# EAGLE schematic LEDSubMatrixHighDensity_v3 (EAGLE 9.6.2)
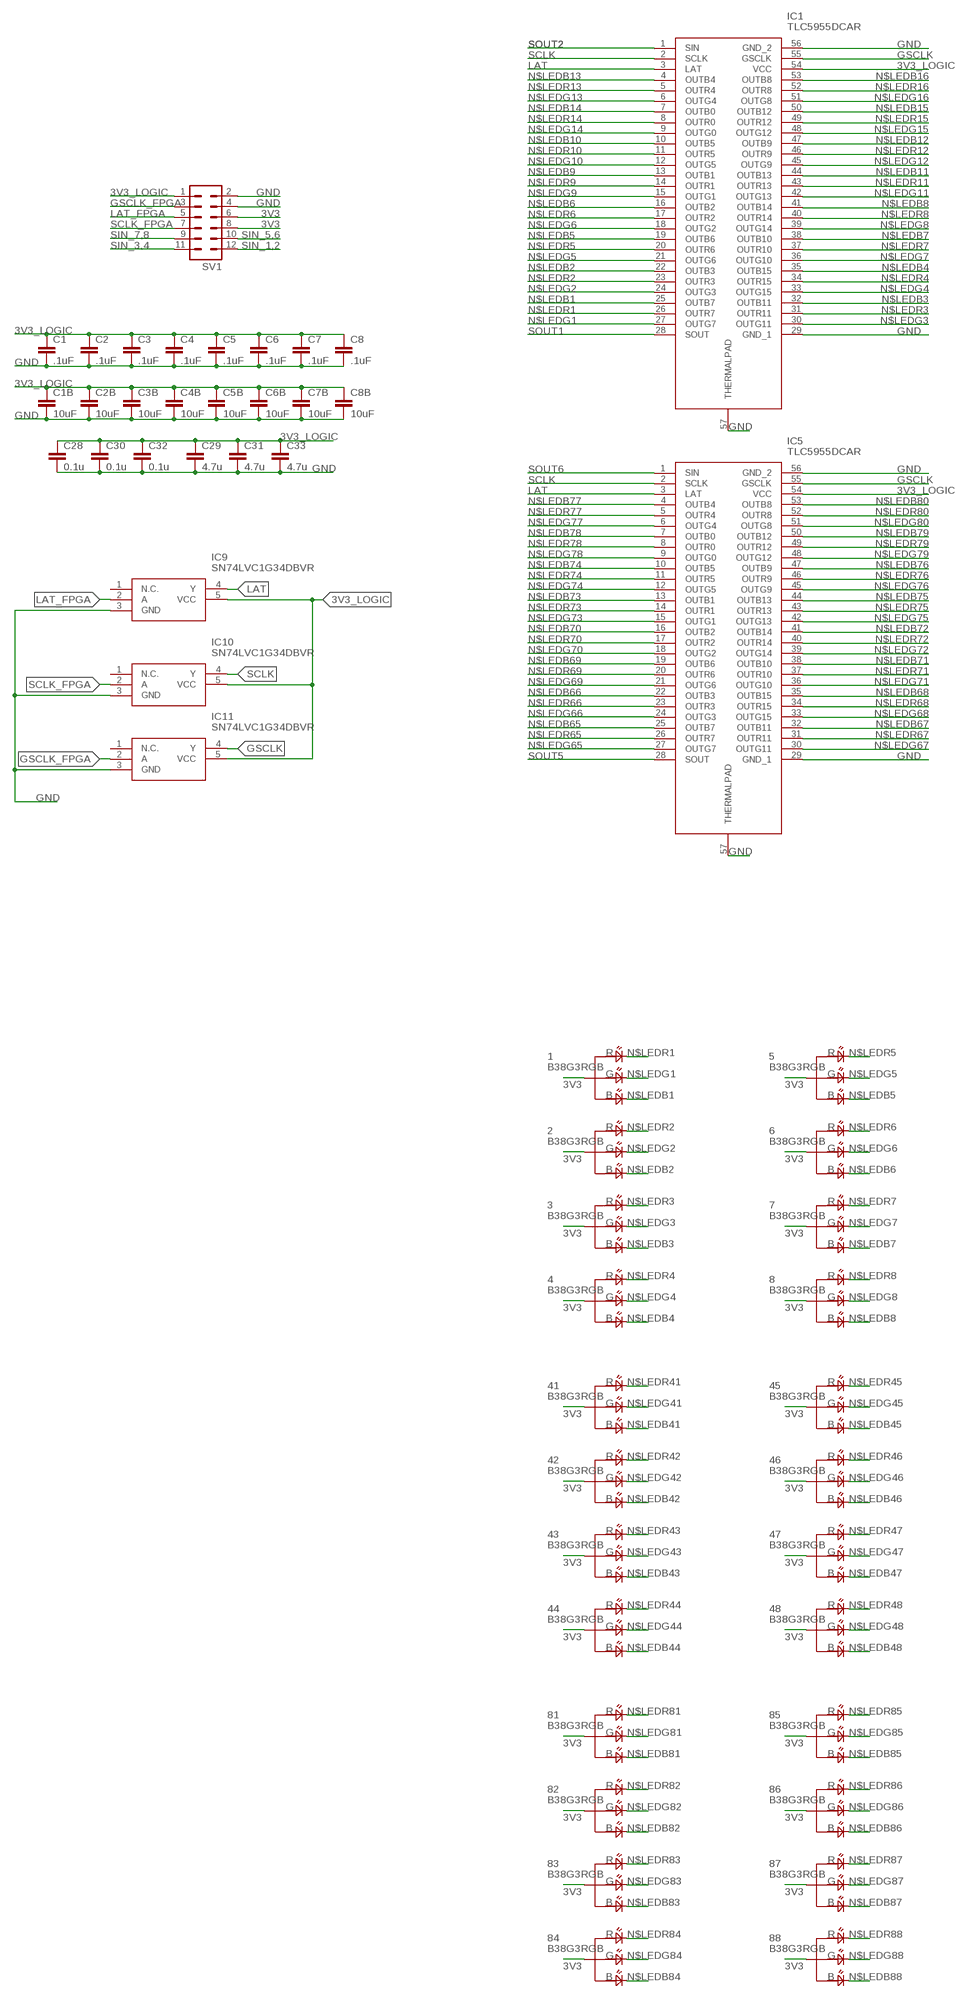
[diagram p0: schematic, sheet 1, part 1 of 2]
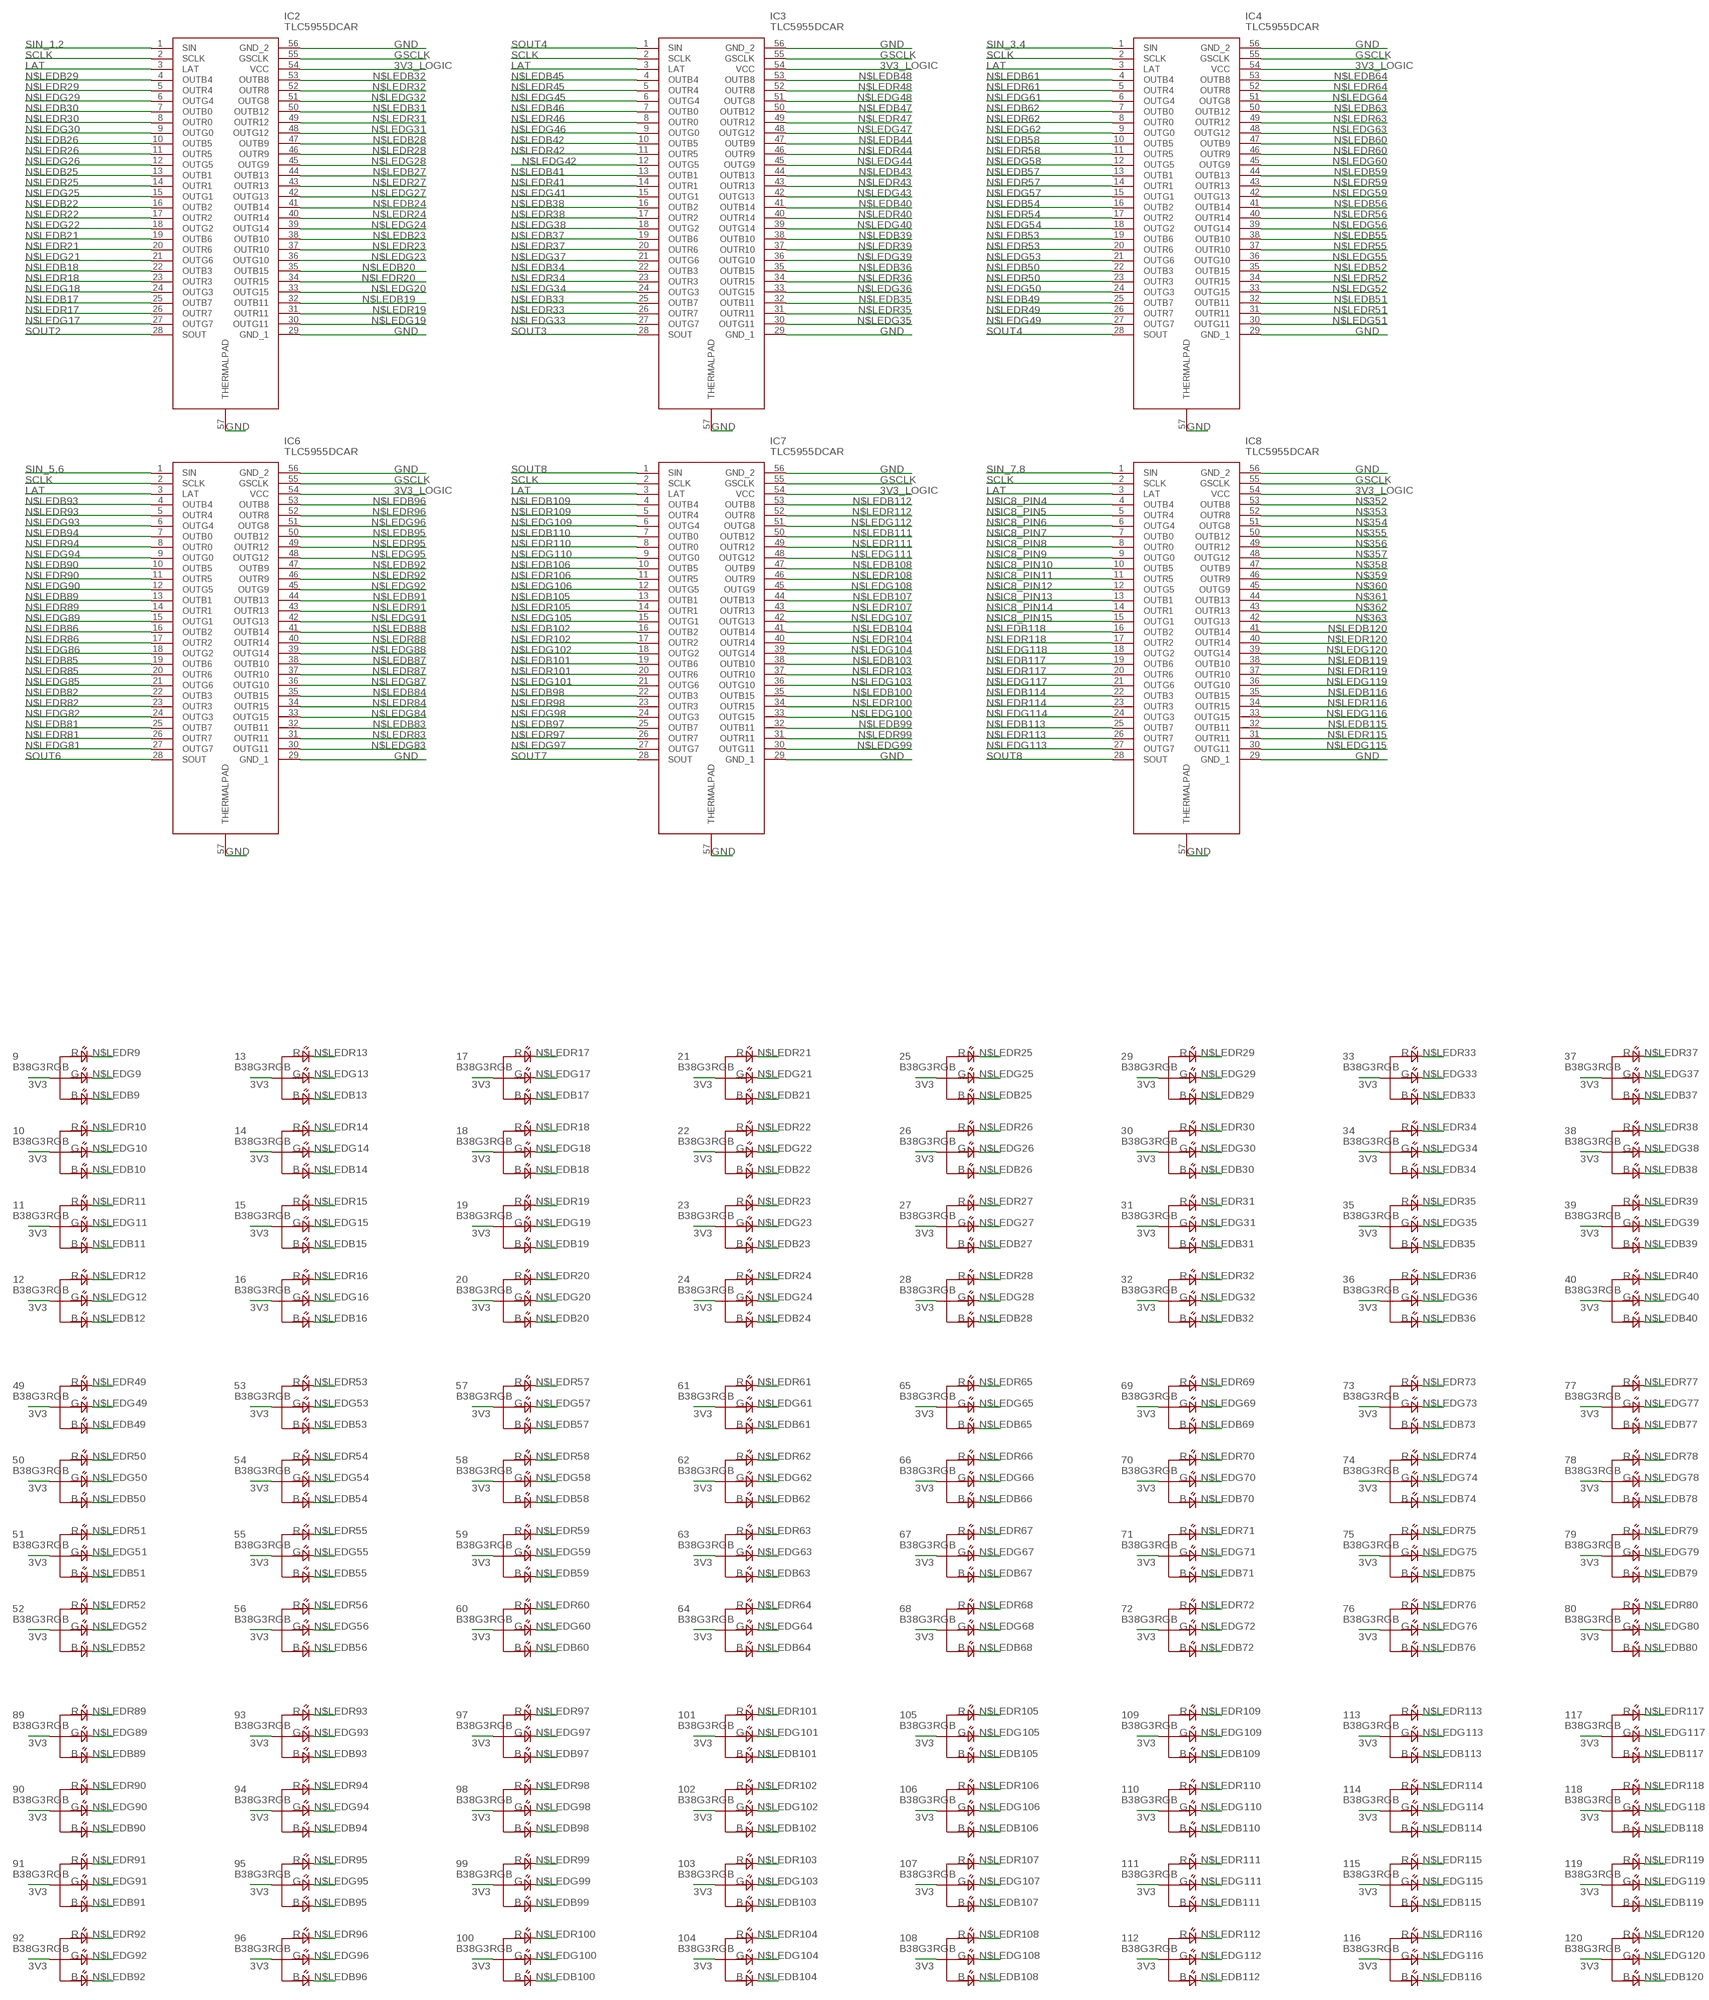
[diagram p1: schematic, sheet 1, part 2 of 2]

## Parts
1  B38G3RGB  [B38G3RGB]
2  B38G3RGB  [B38G3RGB]
3  B38G3RGB  [B38G3RGB]
4  B38G3RGB  [B38G3RGB]
5  B38G3RGB  [B38G3RGB]
6  B38G3RGB  [B38G3RGB]
7  B38G3RGB  [B38G3RGB]
8  B38G3RGB  [B38G3RGB]
9  B38G3RGB  [B38G3RGB]
10  B38G3RGB  [B38G3RGB]
11  B38G3RGB  [B38G3RGB]
12  B38G3RGB  [B38G3RGB]
13  B38G3RGB  [B38G3RGB]
14  B38G3RGB  [B38G3RGB]
15  B38G3RGB  [B38G3RGB]
16  B38G3RGB  [B38G3RGB]
17  B38G3RGB  [B38G3RGB]
18  B38G3RGB  [B38G3RGB]
19  B38G3RGB  [B38G3RGB]
20  B38G3RGB  [B38G3RGB]
21  B38G3RGB  [B38G3RGB]
22  B38G3RGB  [B38G3RGB]
23  B38G3RGB  [B38G3RGB]
24  B38G3RGB  [B38G3RGB]
25  B38G3RGB  [B38G3RGB]
26  B38G3RGB  [B38G3RGB]
27  B38G3RGB  [B38G3RGB]
28  B38G3RGB  [B38G3RGB]
29  B38G3RGB  [B38G3RGB]
30  B38G3RGB  [B38G3RGB]
31  B38G3RGB  [B38G3RGB]
32  B38G3RGB  [B38G3RGB]
33  B38G3RGB  [B38G3RGB]
34  B38G3RGB  [B38G3RGB]
35  B38G3RGB  [B38G3RGB]
36  B38G3RGB  [B38G3RGB]
37  B38G3RGB  [B38G3RGB]
38  B38G3RGB  [B38G3RGB]
39  B38G3RGB  [B38G3RGB]
40  B38G3RGB  [B38G3RGB]
41  B38G3RGB  [B38G3RGB]
42  B38G3RGB  [B38G3RGB]
43  B38G3RGB  [B38G3RGB]
44  B38G3RGB  [B38G3RGB]
45  B38G3RGB  [B38G3RGB]
46  B38G3RGB  [B38G3RGB]
47  B38G3RGB  [B38G3RGB]
48  B38G3RGB  [B38G3RGB]
49  B38G3RGB  [B38G3RGB]
50  B38G3RGB  [B38G3RGB]
51  B38G3RGB  [B38G3RGB]
52  B38G3RGB  [B38G3RGB]
53  B38G3RGB  [B38G3RGB]
54  B38G3RGB  [B38G3RGB]
55  B38G3RGB  [B38G3RGB]
56  B38G3RGB  [B38G3RGB]
57  B38G3RGB  [B38G3RGB]
58  B38G3RGB  [B38G3RGB]
59  B38G3RGB  [B38G3RGB]
60  B38G3RGB  [B38G3RGB]
61  B38G3RGB  [B38G3RGB]
62  B38G3RGB  [B38G3RGB]
63  B38G3RGB  [B38G3RGB]
64  B38G3RGB  [B38G3RGB]
65  B38G3RGB  [B38G3RGB]
66  B38G3RGB  [B38G3RGB]
67  B38G3RGB  [B38G3RGB]
68  B38G3RGB  [B38G3RGB]
69  B38G3RGB  [B38G3RGB]
70  B38G3RGB  [B38G3RGB]
71  B38G3RGB  [B38G3RGB]
72  B38G3RGB  [B38G3RGB]
73  B38G3RGB  [B38G3RGB]
74  B38G3RGB  [B38G3RGB]
75  B38G3RGB  [B38G3RGB]
76  B38G3RGB  [B38G3RGB]
77  B38G3RGB  [B38G3RGB]
78  B38G3RGB  [B38G3RGB]
79  B38G3RGB  [B38G3RGB]
80  B38G3RGB  [B38G3RGB]
81  B38G3RGB  [B38G3RGB]
82  B38G3RGB  [B38G3RGB]
83  B38G3RGB  [B38G3RGB]
84  B38G3RGB  [B38G3RGB]
85  B38G3RGB  [B38G3RGB]
86  B38G3RGB  [B38G3RGB]
87  B38G3RGB  [B38G3RGB]
88  B38G3RGB  [B38G3RGB]
89  B38G3RGB  [B38G3RGB]
90  B38G3RGB  [B38G3RGB]
91  B38G3RGB  [B38G3RGB]
92  B38G3RGB  [B38G3RGB]
93  B38G3RGB  [B38G3RGB]
94  B38G3RGB  [B38G3RGB]
95  B38G3RGB  [B38G3RGB]
96  B38G3RGB  [B38G3RGB]
97  B38G3RGB  [B38G3RGB]
98  B38G3RGB  [B38G3RGB]
99  B38G3RGB  [B38G3RGB]
100  B38G3RGB  [B38G3RGB]
101  B38G3RGB  [B38G3RGB]
102  B38G3RGB  [B38G3RGB]
103  B38G3RGB  [B38G3RGB]
104  B38G3RGB  [B38G3RGB]
105  B38G3RGB  [B38G3RGB]
106  B38G3RGB  [B38G3RGB]
107  B38G3RGB  [B38G3RGB]
108  B38G3RGB  [B38G3RGB]
109  B38G3RGB  [B38G3RGB]
110  B38G3RGB  [B38G3RGB]
111  B38G3RGB  [B38G3RGB]
112  B38G3RGB  [B38G3RGB]
113  B38G3RGB  [B38G3RGB]
114  B38G3RGB  [B38G3RGB]
115  B38G3RGB  [B38G3RGB]
116  B38G3RGB  [B38G3RGB]
117  B38G3RGB  [B38G3RGB]
118  B38G3RGB  [B38G3RGB]
119  B38G3RGB  [B38G3RGB]
120  B38G3RGB  [B38G3RGB]
C1  .1uF  C-EUC0402  [C0402]
C1B  10uF  C-EUC0402  [C0402]
C2  .1uF  C-EUC0402  [C0402]
C2B  10uF  C-EUC0402  [C0402]
C3  .1uF  C-EUC0402  [C0402]
C3B  10uF  C-EUC0402  [C0402]
C4  .1uF  C-EUC0402  [C0402]
C4B  10uF  C-EUC0402  [C0402]
C5  .1uF  C-EUC0402  [C0402]
C5B  10uF  C-EUC0402  [C0402]
C6  .1uF  C-EUC0402  [C0402]
C6B  10uF  C-EUC0402  [C0402]
C7  .1uF  C-EUC0402  [C0402]
C7B  10uF  C-EUC0402  [C0402]
C8  .1uF  C-EUC0402  [C0402]
C8B  10uF  C-EUC0402  [C0402]
C28  0.1u  C-EUC0402  [C0402]
C29  4.7u  C-EUC0402  [C0402]
C30  0.1u  C-EUC0402  [C0402]
C31  4.7u  C-EUC0402  [C0402]
C32  0.1u  C-EUC0402  [C0402]
C33  4.7u  C-EUC0402  [C0402]
IC1  TLC5955DCAR  [SOP50P810X120-57N]
IC2  TLC5955DCAR  [SOP50P810X120-57N]
IC3  TLC5955DCAR  [SOP50P810X120-57N]
IC4  TLC5955DCAR  [SOP50P810X120-57N]
IC5  TLC5955DCAR  [SOP50P810X120-57N]
IC6  TLC5955DCAR  [SOP50P810X120-57N]
IC7  TLC5955DCAR  [SOP50P810X120-57N]
IC8  TLC5955DCAR  [SOP50P810X120-57N]
IC9  SN74LVC1G34DBVR  [SOT95P280X145-5N]
IC10  SN74LVC1G34DBVR  [SOT95P280X145-5N]
IC11  SN74LVC1G34DBVR  [SOT95P280X145-5N]
SV1  MA06-2  [MA06-2]

## Nets
3V3: 1.3(COM) 2.3(COM) 3.3(COM) 4.3(COM) 5.3(COM) 6.3(COM) 7.3(COM) 8.3(COM) 9.3(COM) 10.3(COM) 11.3(COM) 12.3(COM) 13.3(COM) 14.3(COM) 15.3(COM) 16.3(COM) 17.3(COM) 18.3(COM) 19.3(COM) 20.3(COM) 21.3(COM) 22.3(COM) 23.3(COM) 24.3(COM) 25.3(COM) 26.3(COM) 27.3(COM) 28.3(COM) 29.3(COM) 30.3(COM) 31.3(COM) 32.3(COM) 33.3(COM) 34.3(COM) 35.3(COM) 36.3(COM) 37.3(COM) 38.3(COM) 39.3(COM) 40.3(COM) 41.3(COM) 42.3(COM) 43.3(COM) 44.3(COM) 45.3(COM) 46.3(COM) 47.3(COM) 48.3(COM) 49.3(COM) 50.3(COM) 51.3(COM) 52.3(COM) 53.3(COM) 54.3(COM) 55.3(COM) 56.3(COM) 57.3(COM) 58.3(COM) 59.3(COM) 60.3(COM) 61.3(COM) 62.3(COM) 63.3(COM) 64.3(COM) 65.3(COM) 66.3(COM) 67.3(COM) 68.3(COM) 69.3(COM) 70.3(COM) 71.3(COM) 72.3(COM) 73.3(COM) 74.3(COM) 75.3(COM) 76.3(COM) 77.3(COM) 78.3(COM) 79.3(COM) 80.3(COM) 81.3(COM) 82.3(COM) 83.3(COM) 84.3(COM) 85.3(COM) 86.3(COM) 87.3(COM) 88.3(COM) 89.3(COM) 90.3(COM) 91.3(COM) 92.3(COM) 93.3(COM) 94.3(COM) 95.3(COM) 96.3(COM) 97.3(COM) 98.3(COM) 99.3(COM) 100.3(COM) 101.3(COM) 102.3(COM) 103.3(COM) 104.3(COM) 105.3(COM) 106.3(COM) 107.3(COM) 108.3(COM) 109.3(COM) 110.3(COM) 111.3(COM) 112.3(COM) 113.3(COM) 114.3(COM) 115.3(COM) 116.3(COM) 117.3(COM) 118.3(COM) 119.3(COM) 120.3(COM) SV1.6 SV1.8
3V3_LOGIC: C1.1 C1B.1 C2.1 C2B.1 C3.1 C3B.1 C4.1 C4B.1 C5.1 C5B.1 C6.1 C6B.1 C7.1 C7B.1 C8.1 C8B.1 C28.1 C29.1 C30.1 C31.1 C32.1 C33.1 IC1.54(VCC) IC2.54(VCC) IC3.54(VCC) IC4.54(VCC) IC5.54(VCC) IC6.54(VCC) IC7.54(VCC) IC8.54(VCC) IC9.5(VCC) IC10.5(VCC) IC11.5(VCC) SV1.1
GND: C1.2 C1B.2 C2.2 C2B.2 C3.2 C3B.2 C4.2 C4B.2 C5.2 C5B.2 C6.2 C6B.2 C7.2 C7B.2 C8.2 C8B.2 C28.2 C29.2 C30.2 C31.2 C32.2 C33.2 IC1.29(GND_1) IC1.56(GND_2) IC1.57(THERMALPAD) IC2.29(GND_1) IC2.56(GND_2) IC2.57(THERMALPAD) IC3.29(GND_1) IC3.56(GND_2) IC3.57(THERMALPAD) IC4.29(GND_1) IC4.56(GND_2) IC4.57(THERMALPAD) IC5.29(GND_1) IC5.56(GND_2) IC5.57(THERMALPAD) IC6.29(GND_1) IC6.56(GND_2) IC6.57(THERMALPAD) IC7.29(GND_1) IC7.56(GND_2) IC7.57(THERMALPAD) IC8.29(GND_1) IC8.56(GND_2) IC8.57(THERMALPAD) IC9.3(GND) IC10.3(GND) IC11.3(GND) SV1.2 SV1.4
GSCLK: IC1.55(GSCLK) IC2.55(GSCLK) IC3.55(GSCLK) IC4.55(GSCLK) IC5.55(GSCLK) IC6.55(GSCLK) IC7.55(GSCLK) IC8.55(GSCLK) IC11.4(Y)
GSCLK_FPGA: IC11.2(A) SV1.3
LAT: IC1.3(LAT) IC2.3(LAT) IC3.3(LAT) IC4.3(LAT) IC5.3(LAT) IC6.3(LAT) IC7.3(LAT) IC8.3(LAT) IC9.4(Y)
LAT_FPGA: IC9.2(A) SV1.5
N$352: IC8.53(OUTB8)
N$353: IC8.52(OUTR8)
N$354: IC8.51(OUTG8)
N$355: IC8.50(OUTB12)
N$356: IC8.49(OUTR12)
N$357: IC8.48(OUTG12)
N$358: IC8.47(OUTB9)
N$359: IC8.46(OUTR9)
N$360: IC8.45(OUTG9)
N$361: IC8.44(OUTB13)
N$362: IC8.43(OUTR13)
N$363: IC8.42(OUTG13)
N$IC8_PIN4: IC8.4(OUTB4)
N$IC8_PIN5: IC8.5(OUTR4)
N$IC8_PIN6: IC8.6(OUTG4)
N$IC8_PIN7: IC8.7(OUTB0)
N$IC8_PIN8: IC8.8(OUTR0)
N$IC8_PIN9: IC8.9(OUTG0)
N$IC8_PIN10: IC8.10(OUTB5)
N$IC8_PIN11: IC8.11(OUTR5)
N$IC8_PIN12: IC8.12(OUTG5)
N$IC8_PIN13: IC8.13(OUTB1)
N$IC8_PIN14: IC8.14(OUTR1)
N$IC8_PIN15: IC8.15(OUTG1)
N$LEDB1: 1.2(BLUE) IC1.25(OUTB7)
N$LEDB2: 2.2(BLUE) IC1.22(OUTB3)
N$LEDB3: 3.2(BLUE) IC1.32(OUTB11)
N$LEDB4: 4.2(BLUE) IC1.35(OUTB15)
N$LEDB5: 5.2(BLUE) IC1.19(OUTB6)
N$LEDB6: 6.2(BLUE) IC1.16(OUTB2)
N$LEDB7: 7.2(BLUE) IC1.38(OUTB10)
N$LEDB8: 8.2(BLUE) IC1.41(OUTB14)
N$LEDB9: 9.2(BLUE) IC1.13(OUTB1)
N$LEDB10: 10.2(BLUE) IC1.10(OUTB5)
N$LEDB11: 11.2(BLUE) IC1.44(OUTB13)
N$LEDB12: 12.2(BLUE) IC1.47(OUTB9)
N$LEDB13: 13.2(BLUE) IC1.4(OUTB4)
N$LEDB14: 14.2(BLUE) IC1.7(OUTB0)
N$LEDB15: 15.2(BLUE) IC1.50(OUTB12)
N$LEDB16: 16.2(BLUE) IC1.53(OUTB8)
N$LEDB17: 17.2(BLUE) IC2.25(OUTB7)
N$LEDB18: 18.2(BLUE) IC2.22(OUTB3)
N$LEDB19: 19.2(BLUE) IC2.32(OUTB11)
N$LEDB20: 20.2(BLUE) IC2.35(OUTB15)
N$LEDB21: 21.2(BLUE) IC2.19(OUTB6)
N$LEDB22: 22.2(BLUE) IC2.16(OUTB2)
N$LEDB23: 23.2(BLUE) IC2.38(OUTB10)
N$LEDB24: 24.2(BLUE) IC2.41(OUTB14)
N$LEDB25: 25.2(BLUE) IC2.13(OUTB1)
N$LEDB26: 26.2(BLUE) IC2.10(OUTB5)
N$LEDB27: 27.2(BLUE) IC2.44(OUTB13)
N$LEDB28: 28.2(BLUE) IC2.47(OUTB9)
N$LEDB29: 29.2(BLUE) IC2.4(OUTB4)
N$LEDB30: 30.2(BLUE) IC2.7(OUTB0)
N$LEDB31: 31.2(BLUE) IC2.50(OUTB12)
N$LEDB32: 32.2(BLUE) IC2.53(OUTB8)
N$LEDB33: 33.2(BLUE) IC3.25(OUTB7)
N$LEDB34: 34.2(BLUE) IC3.22(OUTB3)
N$LEDB35: 35.2(BLUE) IC3.32(OUTB11)
N$LEDB36: 36.2(BLUE) IC3.35(OUTB15)
N$LEDB37: 37.2(BLUE) IC3.19(OUTB6)
N$LEDB38: 38.2(BLUE) IC3.16(OUTB2)
N$LEDB39: 39.2(BLUE) IC3.38(OUTB10)
N$LEDB40: 40.2(BLUE) IC3.41(OUTB14)
N$LEDB41: 41.2(BLUE) IC3.13(OUTB1)
N$LEDB42: 42.2(BLUE) IC3.10(OUTB5)
N$LEDB43: 43.2(BLUE) IC3.44(OUTB13)
N$LEDB44: 44.2(BLUE) IC3.47(OUTB9)
N$LEDB45: 45.2(BLUE) IC3.4(OUTB4)
N$LEDB46: 46.2(BLUE) IC3.7(OUTB0)
N$LEDB47: 47.2(BLUE) IC3.50(OUTB12)
N$LEDB48: 48.2(BLUE) IC3.53(OUTB8)
N$LEDB49: 49.2(BLUE) IC4.25(OUTB7)
N$LEDB50: 50.2(BLUE) IC4.22(OUTB3)
N$LEDB51: 51.2(BLUE) IC4.32(OUTB11)
N$LEDB52: 52.2(BLUE) IC4.35(OUTB15)
N$LEDB53: 53.2(BLUE) IC4.19(OUTB6)
N$LEDB54: 54.2(BLUE) IC4.16(OUTB2)
N$LEDB55: 55.2(BLUE) IC4.38(OUTB10)
N$LEDB56: 56.2(BLUE) IC4.41(OUTB14)
N$LEDB57: 57.2(BLUE) IC4.13(OUTB1)
N$LEDB58: 58.2(BLUE) IC4.10(OUTB5)
N$LEDB59: 59.2(BLUE) IC4.44(OUTB13)
N$LEDB60: 60.2(BLUE) IC4.47(OUTB9)
N$LEDB61: 61.2(BLUE) IC4.4(OUTB4)
N$LEDB62: 62.2(BLUE) IC4.7(OUTB0)
N$LEDB63: 63.2(BLUE) IC4.50(OUTB12)
N$LEDB64: 64.2(BLUE) IC4.53(OUTB8)
N$LEDB65: 65.2(BLUE) IC5.25(OUTB7)
N$LEDB66: 66.2(BLUE) IC5.22(OUTB3)
N$LEDB67: 67.2(BLUE) IC5.32(OUTB11)
N$LEDB68: 68.2(BLUE) IC5.35(OUTB15)
N$LEDB69: 69.2(BLUE) IC5.19(OUTB6)
N$LEDB70: 70.2(BLUE) IC5.16(OUTB2)
N$LEDB71: 71.2(BLUE) IC5.38(OUTB10)
N$LEDB72: 72.2(BLUE) IC5.41(OUTB14)
N$LEDB73: 73.2(BLUE) IC5.13(OUTB1)
N$LEDB74: 74.2(BLUE) IC5.10(OUTB5)
N$LEDB75: 75.2(BLUE) IC5.44(OUTB13)
N$LEDB76: 76.2(BLUE) IC5.47(OUTB9)
N$LEDB77: 77.2(BLUE) IC5.4(OUTB4)
N$LEDB78: 78.2(BLUE) IC5.7(OUTB0)
N$LEDB79: 79.2(BLUE) IC5.50(OUTB12)
N$LEDB80: 80.2(BLUE) IC5.53(OUTB8)
N$LEDB81: 81.2(BLUE) IC6.25(OUTB7)
N$LEDB82: 82.2(BLUE) IC6.22(OUTB3)
N$LEDB83: 83.2(BLUE) IC6.32(OUTB11)
N$LEDB84: 84.2(BLUE) IC6.35(OUTB15)
N$LEDB85: 85.2(BLUE) IC6.19(OUTB6)
N$LEDB86: 86.2(BLUE) IC6.16(OUTB2)
N$LEDB87: 87.2(BLUE) IC6.38(OUTB10)
N$LEDB88: 88.2(BLUE) IC6.41(OUTB14)
N$LEDB89: 89.2(BLUE) IC6.13(OUTB1)
N$LEDB90: 90.2(BLUE) IC6.10(OUTB5)
N$LEDB91: 91.2(BLUE) IC6.44(OUTB13)
N$LEDB92: 92.2(BLUE) IC6.47(OUTB9)
N$LEDB93: 93.2(BLUE) IC6.4(OUTB4)
N$LEDB94: 94.2(BLUE) IC6.7(OUTB0)
N$LEDB95: 95.2(BLUE) IC6.50(OUTB12)
N$LEDB96: 96.2(BLUE) IC6.53(OUTB8)
N$LEDB97: 97.2(BLUE) IC7.25(OUTB7)
N$LEDB98: 98.2(BLUE) IC7.22(OUTB3)
N$LEDB99: 99.2(BLUE) IC7.32(OUTB11)
N$LEDB100: 100.2(BLUE) IC7.35(OUTB15)
N$LEDB101: 101.2(BLUE) IC7.19(OUTB6)
N$LEDB102: 102.2(BLUE) IC7.16(OUTB2)
N$LEDB103: 103.2(BLUE) IC7.38(OUTB10)
N$LEDB104: 104.2(BLUE) IC7.41(OUTB14)
N$LEDB105: 105.2(BLUE) IC7.13(OUTB1)
N$LEDB106: 106.2(BLUE) IC7.10(OUTB5)
N$LEDB107: 107.2(BLUE) IC7.44(OUTB13)
N$LEDB108: 108.2(BLUE) IC7.47(OUTB9)
N$LEDB109: 109.2(BLUE) IC7.4(OUTB4)
N$LEDB110: 110.2(BLUE) IC7.7(OUTB0)
N$LEDB111: 111.2(BLUE) IC7.50(OUTB12)
N$LEDB112: 112.2(BLUE) IC7.53(OUTB8)
N$LEDB113: 113.2(BLUE) IC8.25(OUTB7)
N$LEDB114: 114.2(BLUE) IC8.22(OUTB3)
N$LEDB115: 115.2(BLUE) IC8.32(OUTB11)
N$LEDB116: 116.2(BLUE) IC8.35(OUTB15)
N$LEDB117: 117.2(BLUE) IC8.19(OUTB6)
N$LEDB118: 118.2(BLUE) IC8.16(OUTB2)
N$LEDB119: 119.2(BLUE) IC8.38(OUTB10)
N$LEDB120: 120.2(BLUE) IC8.41(OUTB14)
N$LEDG1: 1.1(GREEN) IC1.27(OUTG7)
N$LEDG2: 2.1(GREEN) IC1.24(OUTG3)
N$LEDG3: 3.1(GREEN) IC1.30(OUTG11)
N$LEDG4: 4.1(GREEN) IC1.33(OUTG15)
N$LEDG5: 5.1(GREEN) IC1.21(OUTG6)
N$LEDG6: 6.1(GREEN) IC1.18(OUTG2)
N$LEDG7: 7.1(GREEN) IC1.36(OUTG10)
N$LEDG8: 8.1(GREEN) IC1.39(OUTG14)
N$LEDG9: 9.1(GREEN) IC1.15(OUTG1)
N$LEDG10: 10.1(GREEN) IC1.12(OUTG5)
N$LEDG11: 11.1(GREEN) IC1.42(OUTG13)
N$LEDG12: 12.1(GREEN) IC1.45(OUTG9)
N$LEDG13: 13.1(GREEN) IC1.6(OUTG4)
N$LEDG14: 14.1(GREEN) IC1.9(OUTG0)
N$LEDG15: 15.1(GREEN) IC1.48(OUTG12)
N$LEDG16: 16.1(GREEN) IC1.51(OUTG8)
N$LEDG17: 17.1(GREEN) IC2.27(OUTG7)
N$LEDG18: 18.1(GREEN) IC2.24(OUTG3)
N$LEDG19: 19.1(GREEN) IC2.30(OUTG11)
N$LEDG20: 20.1(GREEN) IC2.33(OUTG15)
N$LEDG21: 21.1(GREEN) IC2.21(OUTG6)
N$LEDG22: 22.1(GREEN) IC2.18(OUTG2)
N$LEDG23: 23.1(GREEN) IC2.36(OUTG10)
N$LEDG24: 24.1(GREEN) IC2.39(OUTG14)
N$LEDG25: 25.1(GREEN) IC2.15(OUTG1)
N$LEDG26: 26.1(GREEN) IC2.12(OUTG5)
N$LEDG27: 27.1(GREEN) IC2.42(OUTG13)
N$LEDG28: 28.1(GREEN) IC2.45(OUTG9)
N$LEDG29: 29.1(GREEN) IC2.6(OUTG4)
N$LEDG30: 30.1(GREEN) IC2.9(OUTG0)
N$LEDG31: 31.1(GREEN) IC2.48(OUTG12)
N$LEDG32: 32.1(GREEN) IC2.51(OUTG8)
N$LEDG33: 33.1(GREEN) IC3.27(OUTG7)
N$LEDG34: 34.1(GREEN) IC3.24(OUTG3)
N$LEDG35: 35.1(GREEN) IC3.30(OUTG11)
N$LEDG36: 36.1(GREEN) IC3.33(OUTG15)
N$LEDG37: 37.1(GREEN) IC3.21(OUTG6)
N$LEDG38: 38.1(GREEN) IC3.18(OUTG2)
N$LEDG39: 39.1(GREEN) IC3.36(OUTG10)
N$LEDG40: 40.1(GREEN) IC3.39(OUTG14)
N$LEDG41: 41.1(GREEN) IC3.15(OUTG1)
N$LEDG42: 42.1(GREEN) IC3.12(OUTG5)
N$LEDG43: 43.1(GREEN) IC3.42(OUTG13)
N$LEDG44: 44.1(GREEN) IC3.45(OUTG9)
N$LEDG45: 45.1(GREEN) IC3.6(OUTG4)
N$LEDG46: 46.1(GREEN) IC3.9(OUTG0)
N$LEDG47: 47.1(GREEN) IC3.48(OUTG12)
N$LEDG48: 48.1(GREEN) IC3.51(OUTG8)
N$LEDG49: 49.1(GREEN) IC4.27(OUTG7)
N$LEDG50: 50.1(GREEN) IC4.24(OUTG3)
N$LEDG51: 51.1(GREEN) IC4.30(OUTG11)
N$LEDG52: 52.1(GREEN) IC4.33(OUTG15)
N$LEDG53: 53.1(GREEN) IC4.21(OUTG6)
N$LEDG54: 54.1(GREEN) IC4.18(OUTG2)
N$LEDG55: 55.1(GREEN) IC4.36(OUTG10)
N$LEDG56: 56.1(GREEN) IC4.39(OUTG14)
N$LEDG57: 57.1(GREEN) IC4.15(OUTG1)
N$LEDG58: 58.1(GREEN) IC4.12(OUTG5)
N$LEDG59: 59.1(GREEN) IC4.42(OUTG13)
N$LEDG60: 60.1(GREEN) IC4.45(OUTG9)
N$LEDG61: 61.1(GREEN) IC4.6(OUTG4)
N$LEDG62: 62.1(GREEN) IC4.9(OUTG0)
N$LEDG63: 63.1(GREEN) IC4.48(OUTG12)
N$LEDG64: 64.1(GREEN) IC4.51(OUTG8)
N$LEDG65: 65.1(GREEN) IC5.27(OUTG7)
N$LEDG66: 66.1(GREEN) IC5.24(OUTG3)
N$LEDG67: 67.1(GREEN) IC5.30(OUTG11)
N$LEDG68: 68.1(GREEN) IC5.33(OUTG15)
N$LEDG69: 69.1(GREEN) IC5.21(OUTG6)
N$LEDG70: 70.1(GREEN) IC5.18(OUTG2)
N$LEDG71: 71.1(GREEN) IC5.36(OUTG10)
N$LEDG72: 72.1(GREEN) IC5.39(OUTG14)
N$LEDG73: 73.1(GREEN) IC5.15(OUTG1)
N$LEDG74: 74.1(GREEN) IC5.12(OUTG5)
N$LEDG75: 75.1(GREEN) IC5.42(OUTG13)
N$LEDG76: 76.1(GREEN) IC5.45(OUTG9)
N$LEDG77: 77.1(GREEN) IC5.6(OUTG4)
N$LEDG78: 78.1(GREEN) IC5.9(OUTG0)
N$LEDG79: 79.1(GREEN) IC5.48(OUTG12)
N$LEDG80: 80.1(GREEN) IC5.51(OUTG8)
N$LEDG81: 81.1(GREEN) IC6.27(OUTG7)
N$LEDG82: 82.1(GREEN) IC6.24(OUTG3)
N$LEDG83: 83.1(GREEN) IC6.30(OUTG11)
N$LEDG84: 84.1(GREEN) IC6.33(OUTG15)
N$LEDG85: 85.1(GREEN) IC6.21(OUTG6)
N$LEDG86: 86.1(GREEN) IC6.18(OUTG2)
N$LEDG87: 87.1(GREEN) IC6.36(OUTG10)
N$LEDG88: 88.1(GREEN) IC6.39(OUTG14)
N$LEDG89: 89.1(GREEN) IC6.15(OUTG1)
N$LEDG90: 90.1(GREEN) IC6.12(OUTG5)
N$LEDG91: 91.1(GREEN) IC6.42(OUTG13)
N$LEDG92: 92.1(GREEN) IC6.45(OUTG9)
N$LEDG93: 93.1(GREEN) IC6.6(OUTG4)
N$LEDG94: 94.1(GREEN) IC6.9(OUTG0)
N$LEDG95: 95.1(GREEN) IC6.48(OUTG12)
N$LEDG96: 96.1(GREEN) IC6.51(OUTG8)
N$LEDG97: 97.1(GREEN) IC7.27(OUTG7)
N$LEDG98: 98.1(GREEN) IC7.24(OUTG3)
N$LEDG99: 99.1(GREEN) IC7.30(OUTG11)
N$LEDG100: 100.1(GREEN) IC7.33(OUTG15)
N$LEDG101: 101.1(GREEN) IC7.21(OUTG6)
N$LEDG102: 102.1(GREEN) IC7.18(OUTG2)
N$LEDG103: 103.1(GREEN) IC7.36(OUTG10)
N$LEDG104: 104.1(GREEN) IC7.39(OUTG14)
N$LEDG105: 105.1(GREEN) IC7.15(OUTG1)
N$LEDG106: 106.1(GREEN) IC7.12(OUTG5)
N$LEDG107: 107.1(GREEN) IC7.42(OUTG13)
N$LEDG108: 108.1(GREEN) IC7.45(OUTG9)
N$LEDG109: 109.1(GREEN) IC7.6(OUTG4)
N$LEDG110: 110.1(GREEN) IC7.9(OUTG0)
N$LEDG111: 111.1(GREEN) IC7.48(OUTG12)
N$LEDG112: 112.1(GREEN) IC7.51(OUTG8)
N$LEDG113: 113.1(GREEN) IC8.27(OUTG7)
N$LEDG114: 114.1(GREEN) IC8.24(OUTG3)
N$LEDG115: 115.1(GREEN) IC8.30(OUTG11)
N$LEDG116: 116.1(GREEN) IC8.33(OUTG15)
N$LEDG117: 117.1(GREEN) IC8.21(OUTG6)
N$LEDG118: 118.1(GREEN) IC8.18(OUTG2)
N$LEDG119: 119.1(GREEN) IC8.36(OUTG10)
N$LEDG120: 120.1(GREEN) IC8.39(OUTG14)
N$LEDR1: 1.4(RED) IC1.26(OUTR7)
N$LEDR2: 2.4(RED) IC1.23(OUTR3)
N$LEDR3: 3.4(RED) IC1.31(OUTR11)
N$LEDR4: 4.4(RED) IC1.34(OUTR15)
N$LEDR5: 5.4(RED) IC1.20(OUTR6)
N$LEDR6: 6.4(RED) IC1.17(OUTR2)
N$LEDR7: 7.4(RED) IC1.37(OUTR10)
N$LEDR8: 8.4(RED) IC1.40(OUTR14)
N$LEDR9: 9.4(RED) IC1.14(OUTR1)
N$LEDR10: 10.4(RED) IC1.11(OUTR5)
N$LEDR11: 11.4(RED) IC1.43(OUTR13)
N$LEDR12: 12.4(RED) IC1.46(OUTR9)
N$LEDR13: 13.4(RED) IC1.5(OUTR4)
N$LEDR14: 14.4(RED) IC1.8(OUTR0)
N$LEDR15: 15.4(RED) IC1.49(OUTR12)
N$LEDR16: 16.4(RED) IC1.52(OUTR8)
N$LEDR17: 17.4(RED) IC2.26(OUTR7)
N$LEDR18: 18.4(RED) IC2.23(OUTR3)
N$LEDR19: 19.4(RED) IC2.31(OUTR11)
N$LEDR20: 20.4(RED) IC2.34(OUTR15)
N$LEDR21: 21.4(RED) IC2.20(OUTR6)
N$LEDR22: 22.4(RED) IC2.17(OUTR2)
N$LEDR23: 23.4(RED) IC2.37(OUTR10)
N$LEDR24: 24.4(RED) IC2.40(OUTR14)
N$LEDR25: 25.4(RED) IC2.14(OUTR1)
N$LEDR26: 26.4(RED) IC2.11(OUTR5)
N$LEDR27: 27.4(RED) IC2.43(OUTR13)
N$LEDR28: 28.4(RED) IC2.46(OUTR9)
N$LEDR29: 29.4(RED) IC2.5(OUTR4)
N$LEDR30: 30.4(RED) IC2.8(OUTR0)
N$LEDR31: 31.4(RED) IC2.49(OUTR12)
N$LEDR32: 32.4(RED) IC2.52(OUTR8)
N$LEDR33: 33.4(RED) IC3.26(OUTR7)
N$LEDR34: 34.4(RED) IC3.23(OUTR3)
N$LEDR35: 35.4(RED) IC3.31(OUTR11)
N$LEDR36: 36.4(RED) IC3.34(OUTR15)
N$LEDR37: 37.4(RED) IC3.20(OUTR6)
N$LEDR38: 38.4(RED) IC3.17(OUTR2)
N$LEDR39: 39.4(RED) IC3.37(OUTR10)
N$LEDR40: 40.4(RED) IC3.40(OUTR14)
N$LEDR41: 41.4(RED) IC3.14(OUTR1)
N$LEDR42: 42.4(RED) IC3.11(OUTR5)
N$LEDR43: 43.4(RED) IC3.43(OUTR13)
N$LEDR44: 44.4(RED) IC3.46(OUTR9)
N$LEDR45: 45.4(RED) IC3.5(OUTR4)
N$LEDR46: 46.4(RED) IC3.8(OUTR0)
N$LEDR47: 47.4(RED) IC3.49(OUTR12)
N$LEDR48: 48.4(RED) IC3.52(OUTR8)
N$LEDR49: 49.4(RED) IC4.26(OUTR7)
N$LEDR50: 50.4(RED) IC4.23(OUTR3)
N$LEDR51: 51.4(RED) IC4.31(OUTR11)
N$LEDR52: 52.4(RED) IC4.34(OUTR15)
N$LEDR53: 53.4(RED) IC4.20(OUTR6)
N$LEDR54: 54.4(RED) IC4.17(OUTR2)
N$LEDR55: 55.4(RED) IC4.37(OUTR10)
N$LEDR56: 56.4(RED) IC4.40(OUTR14)
N$LEDR57: 57.4(RED) IC4.14(OUTR1)
N$LEDR58: 58.4(RED) IC4.11(OUTR5)
N$LEDR59: 59.4(RED) IC4.43(OUTR13)
N$LEDR60: 60.4(RED) IC4.46(OUTR9)
N$LEDR61: 61.4(RED) IC4.5(OUTR4)
N$LEDR62: 62.4(RED) IC4.8(OUTR0)
N$LEDR63: 63.4(RED) IC4.49(OUTR12)
N$LEDR64: 64.4(RED) IC4.52(OUTR8)
N$LEDR65: 65.4(RED) IC5.26(OUTR7)
N$LEDR66: 66.4(RED) IC5.23(OUTR3)
N$LEDR67: 67.4(RED) IC5.31(OUTR11)
N$LEDR68: 68.4(RED) IC5.34(OUTR15)
N$LEDR69: 69.4(RED) IC5.20(OUTR6)
N$LEDR70: 70.4(RED) IC5.17(OUTR2)
N$LEDR71: 71.4(RED) IC5.37(OUTR10)
N$LEDR72: 72.4(RED) IC5.40(OUTR14)
N$LEDR73: 73.4(RED) IC5.14(OUTR1)
N$LEDR74: 74.4(RED) IC5.11(OUTR5)
N$LEDR75: 75.4(RED) IC5.43(OUTR13)
N$LEDR76: 76.4(RED) IC5.46(OUTR9)
N$LEDR77: 77.4(RED) IC5.5(OUTR4)
N$LEDR78: 78.4(RED) IC5.8(OUTR0)
N$LEDR79: 79.4(RED) IC5.49(OUTR12)
N$LEDR80: 80.4(RED) IC5.52(OUTR8)
N$LEDR81: 81.4(RED) IC6.26(OUTR7)
N$LEDR82: 82.4(RED) IC6.23(OUTR3)
N$LEDR83: 83.4(RED) IC6.31(OUTR11)
N$LEDR84: 84.4(RED) IC6.34(OUTR15)
N$LEDR85: 85.4(RED) IC6.20(OUTR6)
N$LEDR86: 86.4(RED) IC6.17(OUTR2)
N$LEDR87: 87.4(RED) IC6.37(OUTR10)
N$LEDR88: 88.4(RED) IC6.40(OUTR14)
N$LEDR89: 89.4(RED) IC6.14(OUTR1)
N$LEDR90: 90.4(RED) IC6.11(OUTR5)
N$LEDR91: 91.4(RED) IC6.43(OUTR13)
N$LEDR92: 92.4(RED) IC6.46(OUTR9)
N$LEDR93: 93.4(RED) IC6.5(OUTR4)
N$LEDR94: 94.4(RED) IC6.8(OUTR0)
N$LEDR95: 95.4(RED) IC6.49(OUTR12)
N$LEDR96: 96.4(RED) IC6.52(OUTR8)
N$LEDR97: 97.4(RED) IC7.26(OUTR7)
N$LEDR98: 98.4(RED) IC7.23(OUTR3)
N$LEDR99: 99.4(RED) IC7.31(OUTR11)
N$LEDR100: 100.4(RED) IC7.34(OUTR15)
N$LEDR101: 101.4(RED) IC7.20(OUTR6)
N$LEDR102: 102.4(RED) IC7.17(OUTR2)
N$LEDR103: 103.4(RED) IC7.37(OUTR10)
N$LEDR104: 104.4(RED) IC7.40(OUTR14)
N$LEDR105: 105.4(RED) IC7.14(OUTR1)
N$LEDR106: 106.4(RED) IC7.11(OUTR5)
N$LEDR107: 107.4(RED) IC7.43(OUTR13)
N$LEDR108: 108.4(RED) IC7.46(OUTR9)
N$LEDR109: 109.4(RED) IC7.5(OUTR4)
N$LEDR110: 110.4(RED) IC7.8(OUTR0)
N$LEDR111: 111.4(RED) IC7.49(OUTR12)
N$LEDR112: 112.4(RED) IC7.52(OUTR8)
N$LEDR113: 113.4(RED) IC8.26(OUTR7)
N$LEDR114: 114.4(RED) IC8.23(OUTR3)
N$LEDR115: 115.4(RED) IC8.31(OUTR11)
N$LEDR116: 116.4(RED) IC8.34(OUTR15)
N$LEDR117: 117.4(RED) IC8.20(OUTR6)
N$LEDR118: 118.4(RED) IC8.17(OUTR2)
N$LEDR119: 119.4(RED) IC8.37(OUTR10)
N$LEDR120: 120.4(RED) IC8.40(OUTR14)
SCLK: IC1.2(SCLK) IC2.2(SCLK) IC3.2(SCLK) IC4.2(SCLK) IC5.2(SCLK) IC6.2(SCLK) IC7.2(SCLK) IC8.2(SCLK) IC10.4(Y)
SCLK_FPGA: IC10.2(A) SV1.7
SIN_1,2: IC2.1(SIN) SV1.12
SIN_3,4: IC4.1(SIN) SV1.11
SIN_5,6: IC6.1(SIN) SV1.10
SIN_7,8: IC8.1(SIN) SV1.9
SOUT1: IC1.28(SOUT)
SOUT2: IC1.1(SIN) IC2.28(SOUT)
SOUT3: IC3.28(SOUT)
SOUT4: IC3.1(SIN) IC4.28(SOUT)
SOUT5: IC5.28(SOUT)
SOUT6: IC5.1(SIN) IC6.28(SOUT)
SOUT7: IC7.28(SOUT)
SOUT8: IC7.1(SIN) IC8.28(SOUT)
Unconnected: IC9.1(N.C.) IC10.1(N.C.) IC11.1(N.C.)

## Library data of the parts
1-120 = B38G3RGB:B38G3RGB: Standard LEDs - SMD Surface Mount LEDs Source: Datasheet <https://www.arrow.com/en/products/sml-lx0606igc-tr/lumex>; ARROW_PART_NUMBER: SML-LX0606IGC-TR; ARROW_PRICE-STOCK: https://www.arrow.com/en/products/sml-lx0606igc-tr/lumex; DESCRIPTION: Standard LEDs - SMD Surface Mount LEDs; HEIGHT: 0.7mm; MANUFACTURER_NAME: Lumex; MANUFACTURER_PART_NUMBER: SML-LX0606IGC-TR; MOUSER_PART_NUMBER: 696-SML-0606IGCTR; MOUSER_PRICE-STOCK: https://www.mouser.co.uk/ProductDetail/Lumex/SML-LX0606IGC-TR?qs=I1ILoAvtKy%252BVd7WFwiUkZQ%3D%3D
C1 C1B C2 C2B C3 C3B C4 C4B C5 C5B C6 C6B C7 C7B C8 C8B C28-C33 = rcl:C-EU: CAPACITOR, European symbol; SPICEPREFIX: C
IC1-IC8 = TLC5955DCAR:TLC5955DCAR: 48ch, 16bit PWM LED Driver with Dot-Correction, Brightness Control, Open/Short Detection Source: Datasheet <http://www.ti.com/lit/ds/symlink/tlc5955.pdf>; ARROW_PART_NUMBER: TLC5955DCAR; ARROW_PRICE-STOCK: https://www.arrow.com/en/products/tlc5955dcar/texas-instruments; DESCRIPTION: 48ch, 16bit PWM LED Driver with Dot-Correction, Brightness Control, Open/Short Detection; HEIGHT: 1.2mm; MANUFACTURER_NAME: Texas Instruments; MANUFACTURER_PART_NUMBER: TLC5955DCAR; MOUSER_PART_NUMBER: 595-TLC5955DCAR; MOUSER_PRICE-STOCK: https://www.mouser.co.uk/ProductDetail/Texas-Instruments/TLC5955DCAR?qs=%2Fd%252BFzHvH4c3zo%2FeGYG5n7g%3D%3D
IC9-IC11 = SN74LVC1G34DBVR:SN74LVC1G34DBVR: Single Buffer Gate Source: Datasheet <http://www.ti.com/lit/gpn/sn74lvc1g34>; ARROW_PART_NUMBER: SN74LVC1G34DBVR; ARROW_PRICE-STOCK: https://www.arrow.com/en/products/sn74lvc1g34dbvr/texas-instruments?region=nac; DESCRIPTION: Single Buffer Gate; HEIGHT: 1.45mm; MANUFACTURER_NAME: Texas Instruments; MANUFACTURER_PART_NUMBER: SN74LVC1G34DBVR; MOUSER_PART_NUMBER: 595-SN74LVC1G34DBVR; MOUSER_PRICE-STOCK: https://www.mouser.co.uk/ProductDetail/Texas-Instruments/SN74LVC1G34DBVR?qs=dT9u2OTAaVXXjYSQb2wcdg%3D%3D
SV1 = VoxelEagleLib:MA06-2: PIN HEADER; OC_FARNELL: unknown; OC_NEWARK: unknown